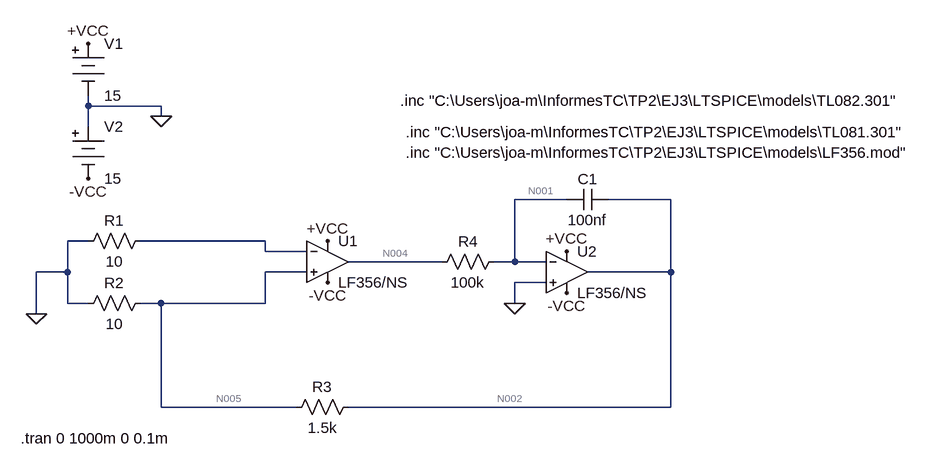
[diagram p0: schematic EJ3.asc]
EJ3.asc, the LTspice schematic file:
Version 4
SHEET 1 1384 680
WIRE 32 -80 32 -96
WIRE 144 -80 32 -80
WIRE 144 -64 144 -80
WIRE 32 -48 32 -80
WIRE 768 64 688 64
WIRE 928 64 832 64
WIRE 32 128 0 128
WIRE 304 128 112 128
WIRE 304 144 304 128
WIRE 368 144 304 144
WIRE 576 160 432 160
WIRE 688 160 688 64
WIRE 688 160 656 160
WIRE 736 160 688 160
WIRE 0 176 0 128
WIRE 0 176 -48 176
WIRE 368 176 304 176
WIRE 928 176 928 64
WIRE 928 176 800 176
WIRE 736 192 688 192
WIRE 0 224 0 176
WIRE 32 224 0 224
WIRE 144 224 112 224
WIRE 304 224 304 176
WIRE 304 224 144 224
WIRE 688 224 688 192
WIRE -48 240 -48 176
WIRE 144 384 144 224
WIRE 352 384 144 384
WIRE 928 384 928 176
WIRE 928 384 432 384
FLAG 688 224 0
FLAG -48 240 0
FLAG 32 -176 +VCC
FLAG 32 32 -VCC
FLAG 144 -64 0
FLAG 400 128 +VCC
FLAG 768 144 +VCC
FLAG 400 192 -VCC
FLAG 768 208 -VCC
SYMBOL res 128 112 R90
WINDOW 0 0 56 VBottom 2
WINDOW 3 32 56 VTop 2
SYMATTR InstName R1
SYMATTR Value 10
SYMBOL res 128 208 R90
WINDOW 0 0 56 VBottom 2
WINDOW 3 32 56 VTop 2
SYMATTR InstName R2
SYMATTR Value 10
SYMBOL res 448 368 R90
WINDOW 0 0 56 VBottom 2
WINDOW 3 32 56 VTop 2
SYMATTR InstName R3
SYMATTR Value 1.5k
SYMBOL res 672 144 R90
WINDOW 0 0 56 VBottom 2
WINDOW 3 32 56 VTop 2
SYMATTR InstName R4
SYMATTR Value 100k
SYMBOL cap 832 48 R90
WINDOW 0 0 32 VBottom 2
WINDOW 3 32 32 VTop 2
SYMATTR InstName C1
SYMATTR Value 100nf
SYMBOL Opamps\\opamp2 400 96 R0
SYMATTR InstName U1
SYMATTR Value LF356/NS
SYMATTR SpiceModel LF356/NS
SYMBOL Opamps\\opamp2 768 112 R0
SYMATTR InstName U2
SYMATTR Value LF356/NS
SYMATTR SpiceModel LF356/NS
SYMBOL Misc\\battery 32 -192 R0
WINDOW 123 0 0 Left 0
WINDOW 39 0 0 Left 0
SYMATTR InstName V1
SYMATTR Value 15
SYMBOL Misc\\battery 32 -64 R0
WINDOW 123 0 0 Left 0
WINDOW 39 0 0 Left 0
SYMATTR InstName V2
SYMATTR Value 15
TEXT 520 -40 Left 2 !.inc "C:\\Users\\joa-m\\InformesTC\\TP2\\EJ3\\LTSPICE\\models\\TL081.301"
TEXT 520 -8 Left 2 !.inc "C:\\Users\\joa-m\\InformesTC\\TP2\\EJ3\\LTSPICE\\models\\LF356.mod"
TEXT -72 432 Left 2 !.tran 0 1000m 0 0.1m
TEXT 512 -88 Left 2 !.inc "C:\\Users\\joa-m\\InformesTC\\TP2\\EJ3\\LTSPICE\\models\\TL082.301"

The netlist it stands for:
* EJ3.asc
R1 N003 0 10
R2 N005 0 10
R3 N002 N005 1.5k
R4 N001 N004 100k
C1 N002 N001 100nf
XU1 N005 N003 +VCC -VCC N004 LF356/NS LF356/NS  ; pins In+ In- V+ V- OUT
XU2 0 N001 +VCC -VCC N002 LF356/NS LF356/NS  ; pins In+ In- V+ V- OUT
V1 +VCC 0 15
V2 0 -VCC 15
.inc "C:\Users\joa-m\InformesTC\TP2\EJ3\LTSPICE\models\TL081.301"
.inc "C:\Users\joa-m\InformesTC\TP2\EJ3\LTSPICE\models\LF356.mod"
.tran 0 1000m 0 0.1m
.inc "C:\Users\joa-m\InformesTC\TP2\EJ3\LTSPICE\models\TL082.301"
.backanno
.end

* Results of the author's LTspice run, read from the files saved beside the schematic
* Operating Point, zero values left out:
*   V(n005) = -3.001 mV
*   V(n002) = -453.1 mV
*   V(n001) = 3.002 mV
*   V(n004) = 3.007 mV
*   V(+vcc) = 15 V
*   V(-vcc) = -15 V
*   I(R4) = -47.01 pA
*   I(R3) = -300.1 µA
*   I(R2) = -300.1 µA
*   I(R1) = -47 pA
*   I(V2) = -10.4 mA
*   I(V1) = -10.1 mA
*   Ix(u1:1) = 41 pA
*   Ix(u1:2) = 47 pA
*   Ix(u1:99) = 5.05 mA
*   Ix(u1:50) = -5.05 mA
*   Ix(u1:28) = -47.01 pA
*   Ix(u2:1) = 41 pA
*   Ix(u2:2) = 47.01 pA
*   Ix(u2:99) = 5.05 mA
*   Ix(u2:50) = -5.35 mA
*   Ix(u2:28) = 300.1 µA
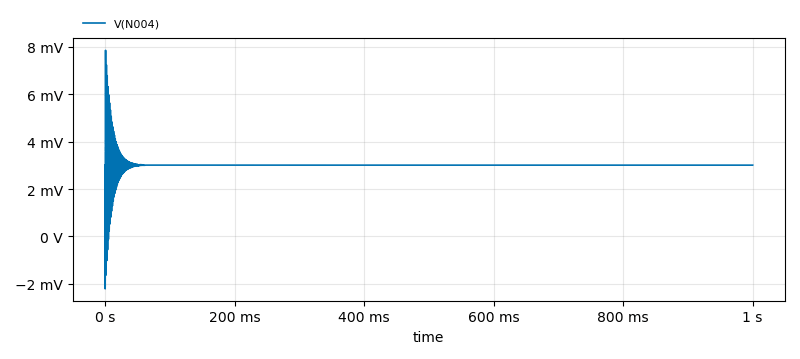
[diagram p1: Transient Analysis of EJ3.asc, plotted from the saved traces]
* Transient Analysis, 1 run:
*   V(N004): min -2.211 mV, max 7.85 mV, average 3.006 mV, rms 3.018 mV, last 3.007 mV